# EAGLE schematic BATT_DCDC (1) (EAGLE 9.5.2)
COMPANY: ADAFRUIT INDUSTRIES; DRAWN: KTOWN; REV: B
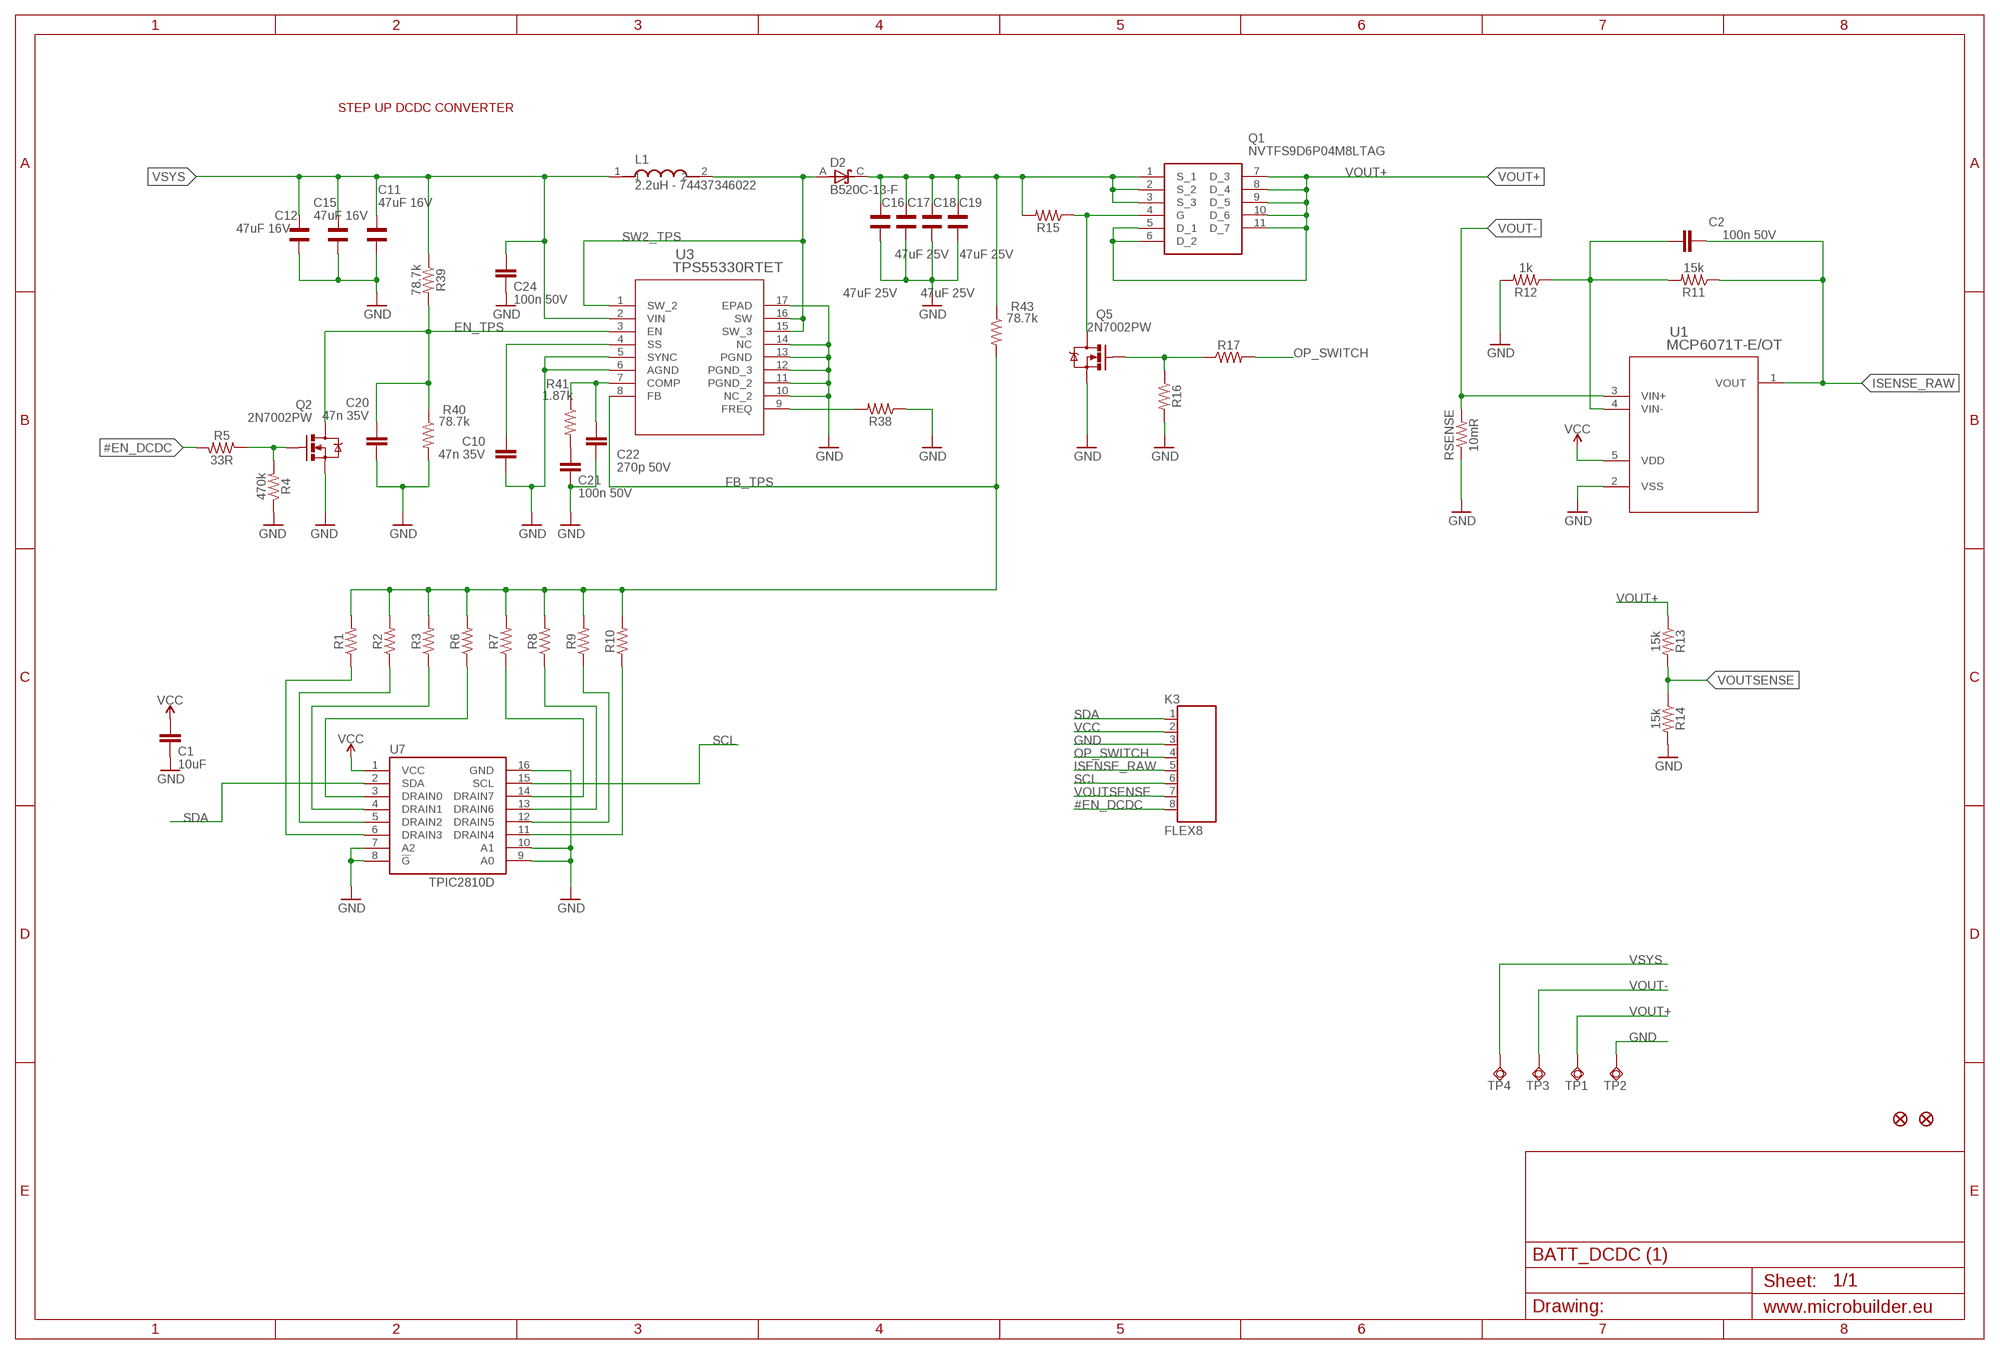
[diagram p0: schematic, sheet 1]

## Parts
C1  10uF  10UF-0603-6.3V-20%  [0603]
C2  100n 50V  10UF-0805-25V-10%  [0805@1]
C10  47n 35V  10UF-0805-25V-10%  [0805@1]
C11  47uF 16V  WCAP-CSGP_1210_885012109003  [WCAP-CSGP_1210]
C12  47uF 16V  WCAP-CSGP_1210_885012109003  [WCAP-CSGP_1210]
C15  47uF 16V  WCAP-CSGP_1210_885012109003  [WCAP-CSGP_1210]
C16  47uF 25V  WCAP-CSGP_1210_885012109003  [WCAP-CSGP_1210]
C17  47uF 25V  WCAP-CSGP_1210_885012109003  [WCAP-CSGP_1210]
C18  47uF 25V  WCAP-CSGP_1210_885012109003  [WCAP-CSGP_1210]
C19  47uF 25V  WCAP-CSGP_1210_885012109003  [WCAP-CSGP_1210]
C20  47n 35V  10UF-0805-25V-10%  [0805@1]
C21  100n 50V  10UF-0805-25V-10%  [0805@1]
C22  270p 50V  10UF-0805-25V-10%  [0805@1]
C24  100n 50V  10UF-0805-25V-10%  [0805@1]
D2  B520C-13-F  [DIOM7959X250N]
K3  FLEX8  [FLEX8]
L1  2.2uH - 74437346022  74437349100  [INDM7366X500]
Q1  NVTFS9D6P04M8LTAG  [NVTFS5124PLTWG]
Q2  2N7002PW  MOSFET-NCHANNEL2N7002PW  [SOT323]
Q5  2N7002PW  MOSFET-NCHANNEL2N7002PW  [SOT323]
R1  RESISTOR0402  [0402]
R2  RESISTOR0402  [0402]
R3  RESISTOR0402  [0402]
R4  470k  RESISTOR0402  [0402]
R5  33R  RESISTOR0402  [0402]
R6  RESISTOR0402  [0402]
R7  RESISTOR0402  [0402]
R8  RESISTOR0402  [0402]
R9  RESISTOR0402  [0402]
R10  RESISTOR0402  [0402]
R11  15k  RESISTOR0402  [0402]
R12  1k  RESISTOR0402  [0402]
R13  15k  RESISTOR0402  [0402]
R14  15k  RESISTOR0402  [0402]
R15  RESISTOR0402  [0402]
R16  RESISTOR0402  [0402]
R17  RESISTOR0402  [0402]
R38  RESISTOR0805  [0805]
R39  78.7k  RESISTOR0402  [0402]
R40  78.7k  RESISTOR0402  [0402]
R41  1.87k  RESISTOR0402  [0402]
R43  78.7k  RESISTOR0805  [0805]
RSENSE  10mR  RESISTOR0603  [0603]
TP1  TESTPAD_TPSQTP15SQ  [TESTPAD_TP15SQ]
TP2  TESTPAD_TPSQTP15SQ  [TESTPAD_TP15SQ]
TP3  TESTPAD_TPSQTP15SQ  [TESTPAD_TP15SQ]
TP4  TESTPAD_TPSQTP15SQ  [TESTPAD_TP15SQ]
U1  MCP6071T-E/OT  [SOT-23-5_MC_MCH]
U3  TPS55330RTET  [RTE16_1P66X1P66_TEX]
U7  TPIC2810D  [SO16]
U$34  FIDUCIAL""  [FIDUCIAL_1MM]
U$35  FIDUCIAL""  [FIDUCIAL_1MM]

## Nets
#EN_DCDC: K3.8 R5.2
COMP_TPS: C22.2 R41.1 U3.7(COMP)
EN_TPS: C20.1 Q2.3(D) R39.2 R40.1 U3.3(EN)
FB_TPS: R1.2 R2.2 R3.2 R6.2 R7.2 R8.2 R9.2 R10.2 R43.2 U3.8(FB)
FREQ_TPS: R38.2 U3.9(FREQ)
GND: C1.1 C10.2 C11.1 C12.1 C15.1 C16.1 C17.1 C18.1 C19.1 C20.2 C21.1 C22.1 C24.1 K3.3 Q2.2(S) Q5.2(S) R4.1 R12.2 R14.2 R16.2 R38.1 R40.2 RSENSE.1 TP2.TP U1.2(VSS) U3.5(SYNC) U3.6(AGND) U3.10(NC_2) U3.11(PGND_2) U3.12(PGND_3) U3.13(PGND) U3.14(NC) U3.17(EPAD) U7.7(A2) U7.8(!G) U7.9(A0) U7.10(A1) U7.16(GND)
ISENSE_RAW: C2.1 K3.5 R11.1 U1.1(VOUT)
N$1: C2.2 R11.2 R12.1 U1.4(VIN-)
N$2: R1.1 U7.6(DRAIN3)
N$3: R2.1 U7.5(DRAIN2)
N$4: Q2.1(G) R4.2 R5.1
N$5: R3.1 U7.4(DRAIN1)
N$6: R6.1 U7.3(DRAIN0)
N$7: R7.1 U7.14(DRAIN7)
N$8: Q1.4(G) Q5.3(D) R15.1
N$9: R8.1 U7.13(DRAIN6)
N$10: R9.1 U7.12(DRAIN5)
N$11: R10.1 U7.11(DRAIN4)
N$13: Q5.1(G) R16.1 R17.1
N$35: C10.1 U3.4(SS)
N$43: C21.2 R41.2
OP_SWITCH: K3.4 R17.2
SCL: K3.6 U7.15(SCL)
SDA: K3.1 U7.2(SDA)
SW2_TPS: D2.A L1.2 U3.1(SW_2) U3.15(SW_3) U3.16(SW)
VCC: C1.2 K3.2 U1.5(VDD) U7.1(VCC)
VOUT+: Q1.5(D_1) Q1.6(D_2) Q1.7(D_3) Q1.8(D_4) Q1.9(D_5) Q1.10(D_6) Q1.11(D_7) R13.1 TP1.TP
VOUT-: RSENSE.2 TP3.TP U1.3(VIN+)
VOUTSENSE: K3.7 R13.2 R14.1
VSOURCE: C16.2 C17.2 C18.2 C19.2 D2.C Q1.1(S_1) Q1.2(S_2) Q1.3(S_3) R15.2 R43.1
VSYS: C11.2 C12.2 C15.2 C24.2 L1.1 R39.1 TP4.TP U3.2(VIN)

## Notes on the sheet
- STEP UP DCDC CONVERTER

## Library data of the parts
C1 = SparkFun-Capacitors:10UF: 10.0µF ceramic capacitors A capacitor is a passive two-terminal electrical component used to store electrical energy temporarily in an electric field.; PROD_ID: CAP-11015
C2 C10 C20-C22 C24 = SparkFun-Capacitors:10UF: 10.0µF ceramic capacitors A capacitor is a passive two-terminal electrical component used to store electrical energy temporarily in an electric field.; PROD_ID: CAP-14259; VALUE: 10uF
C11 C12 C15-C19 = Wurth_Elektronik_Passive_Capacitors_rev19a:WCAP-CSGP_1210: WCAP-CSGP Ceramic Capacitors Characteristics Multilayer Ceramic Chip Capacitor Recommended soldering:Reflow, for 0603 and 0805 wave soldering is also allowed Operating temperature:-55 °C to +125 °C; Ceramic characteristics: Class I - NPO ; Class II -X7R, X5R High performance ceramic High capacitance stability Minimal aging Termination:Cu/Ni/Sn <http://katalog.we-online.de/media/images/eisos/WCAP-CSGP_pf2.jpg> Details see: http://katalog.we-online.de/en/pbs/WCAP-CSGP-1210? Created: 2015-01-28 2015 (C) Wurth Elektronik; WE-NUMBER: 885012109003/47uF
D2 = B520C-13-F:B520C-13-F: 5.0A SURFACE MOUNT SCHOTTKY BARRIER RECTIFIER; AVAILABILITY: Unavailable; DESCRIPTION: Diode Schottky 20V 5A Surface Mount SMC; DIGIKEY-PURCHASE-URL: https://snapeda.com/shop?store=DigiKey&id=325969; MF: Diodes Inc.; MP: B520C-13-F; PACKAGE: DO-214 Diodes Inc.; PRICE: None
K3 = Flex_Faja_connector:FLEX8: WR-FPC 1mm SMT Horiz. Bot. Contact Hinge type WR-FPC 1mm 08 pins Hinge type SMT Horizontal Bottom Contact ;=>Code : Con_FPC_ZIF_1.00_6861xx148922_686108148922 <http://katalog.we-online.de/media/images/eican/Con_FPC_ZIF_1.00_686110148922_pf2.jpg> Details see: http://katalog.we-online.de/em/datasheet/6861xx148922.pdf Created 2014-10-08, Karrer Zheng 2014 (C) Wurth Elektronik
L1 = Inductance_2.2uH:74437349100: Inductor, SMD [Würth Elektronik] 74437349100 Inductor, SMD; DESCRIPTION: 10µH Shielded Molded Inductor 3.2A 69mOhm Max Nonstandard; DIGIKEY-PURCHASE-URL: https://snapeda.com/shop?store=DigiKey&id=586788; MF: Wurth Electronics; MP: 74437349100; PACKAGE: Nonstandard Wurth Electronics
Q1 = SamacSys_Parts:NVTFS9D6P04M8LTAG: MOSFET MV8 P INITIAL PROGRAM Source: Datasheet <https://www.onsemi.com/pub/Collateral/NVTFS9D6P04M8L-D.PDF>; DESCRIPTION: MOSFET MV8 P INITIAL PROGRAM; HEIGHT: 0.8mm; MANUFACTURER_NAME: ON Semiconductor; MANUFACTURER_PART_NUMBER: NVTFS9D6P04M8LTAG; MOUSER_PART_NUMBER: 863-NVTFS9D6P04M8LTG; MOUSER_PRICE-STOCK: https://www.mouser.co.uk/ProductDetail/ON-Semiconductor/NVTFS9D6P04M8LTAG/?qs=xZ%2FP%252Ba9zWqYALd8g5rll2Q%3D%3D
Q2 Q5 = SparkFun-DiscreteSemi:MOSFET-NCHANNEL: Common NMOSFET Parts MFG P/N Store ID Prod ID FDD8780 TRANS-09984 SI7820DN TRANS-11055 FDS6630A IC-08089 2N7002PW TRANS-11151 FQP30N06L COM-10213 TRANS-10060 BSS123LT1G TRANS-08345 BSS138 TRANS-00830 BS170 2N7000; PROD_ID: TRANS-11151
R1-R17 R38-R41 R43 RSENSE = SparkFun-Resistors:RESISTOR: Generic Resistor Package
TP1-TP4 = BeagleBone_Blue_R3:TESTPAD_TPSQ: Test pad
U1 = MCP6071:MCP6071T-E/OT; BUILT_BY: EMA_Jessica; COPYRIGHT: Copyright (C) 2018 Accelerated Designs. All rights reserved; MANUFACTURER_PART_NUMBER: MCP6071T-E/OT; SOURCELIBRARY: Microchip_2019-08-23_21; VENDOR: Microchip
U3 = TPS55330:TPS55330RTET; BUILT_BY: EMA_UL_Team; MANUFACTURER_PART_NUMBER: TPS55330RTET; SOURCELIBRARY: TI_2015-1-5; VENDOR: Texas Instruments
U7 = EDCPSU - Rev2:TPIC2810D
U$34 U$35 = microbuilder:FIDUCIAL: Fiducial Alignment Points Various fiducial points for machine vision alignment.; BOM: EXCLUDE

## Net classes
2 gnd: width 0.305 mm, drill 0.483 mm, clearance 0.203 mm